# Altium project lab2_zasetskiy_buck.PrjPcb
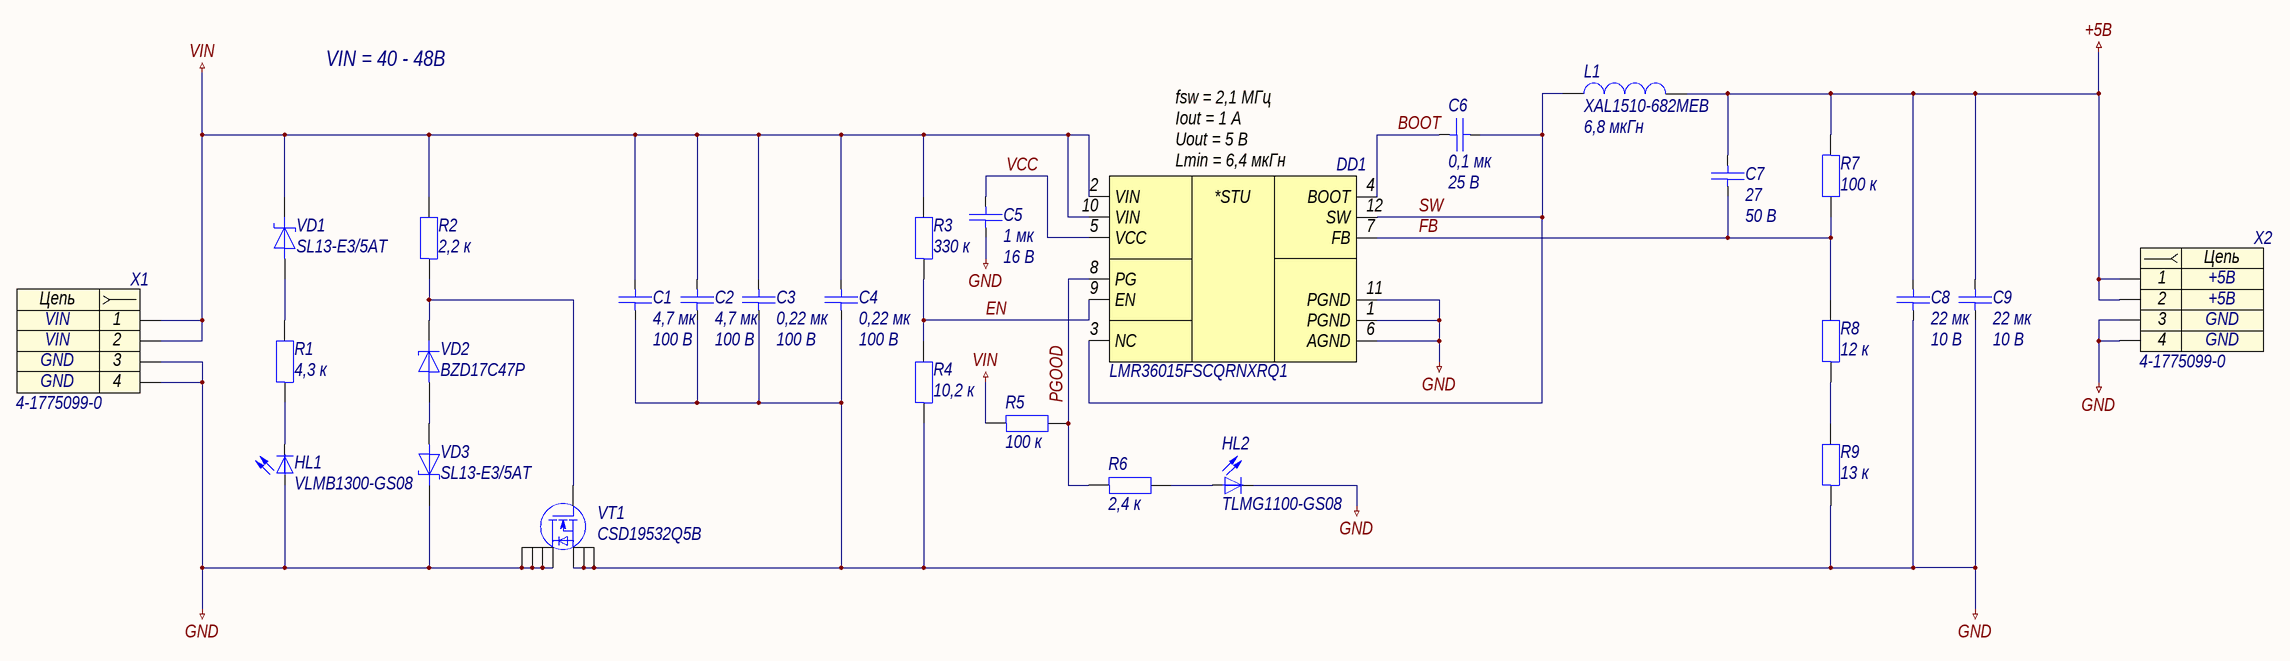
[diagram p0: lab2_zasetskiy_buck.SchDoc]
approver: Капустин; check: Капустин; designation: СПБПУ.3331506.06; developer: Засецкий; document_code: Ý3; document_type: Схема электрическая принципиальная; pcb_dec_number: СПБПУ.3331506.06; project: Лабораторная работа №2; sheets_total: M; title: Понижающий преобразователь; title_line_1: Понижающий; title_line_2: преобразователь
1 sheet, 28 parts. Net scope: global (net labels, ports and power ports of the same name join across sheets).
Board file: lab2_zasetskiy_buck.PcbDoc

## Sheet lab2_zasetskiy_buck.SchDoc: Понижающий преобразователь
size 594 x 420 mm; ApprovedBy: Капустин; CheckedBy: Капустин; DrawnBy: Засецкий; DocumentNumber: СПБПУ.3331506.06Ý3; SheetNumber: n; SheetTotal: M; DocumentCode: Ý3; ImagePath: СПБПУ.3331506.06

### Parts
C1  4,7 мк  Напряжение: 100 В  [C1210]
C2  4,7 мк  Напряжение: 100 В  [C1210]
C3  0,22 мк  Напряжение: 100 В  [C0805]
C4  0,22 мк  Напряжение: 100 В  [C0805]
C5  1 мк  Напряжение: 16 В  [C0603]
C6  0,1 мк  Напряжение: 25 В  [C0603]
C7  27  Напряжение: 50 В  [C0402]
C8  22 мк  Напряжение: 10 В  [C1206]
C9  22 мк  Напряжение: 10 В  [C1206]
DD1  LMR36015FSCQRNXRQ1  [VQFN-HR-12]
HL1  VLMB1300-GS08  [LED]
HL2  TLMG1100-GS08  [LED_GREEN]
L1  XAL1510-682MEB  Индуктивность: 6,8 мкГн  [XAL-2-1620X1520X1100]
R1  4,3 к  [R0603]
R2  2,2 к  [R0603]
R3  330 к  [R0603]
R4  10,2 к  [R0603]
R5  100 к  [R0603]
R6  2,4 к  [R0603]
R7  100 к  [R0603]
R8  12 к  [R0603]
R9  13 к  [R0603]
VD1  SL13-E3/5AT  [DO-214AC]
VD2  BZD17C47P  [DO-219AB]
VD3  SL13-E3/5AT  [DO-214AC]
VT1  CSD19532Q5B  [SON-8]
X1  4-1775099-0  [4-1775099-0]
X2  4-1775099-0  [4-1775099-0]

### Nets
+5В: C7.1 C8.1 C9.1 L1.2 R7.1 X2.1 X2.2
GND: C1.2 C2.2 C3.2 C4.2 C5.2 C8.2 C9.2 DD1.1(PGND) DD1.6(AGND) DD1.11(PGND) HL1.1(A) HL2.2(K) R4.1 R9.1 VD3.1 VT1.D VT1.S X1.3 X1.4 X2.3 X2.4
VIN: C1.1 C2.1 C3.1 C4.1 DD1.2(VIN) DD1.10(VIN) R2.2 R3.2 R5.1 VD1.1 X1.1 X1.2
BOOT: C6.2 DD1.4(BOOT)
EN: DD1.9(EN) R3.1 R4.2
FB: C7.2 DD1.7(FB) R7.2 R8.2
PGOOD: DD1.8(PG) R5.2 R6.1
SW: C6.1 DD1.3(NC) DD1.12(SW) L1.1
VCC: C5.1 DD1.5(VCC)
NetHL1_2: HL1.2(K) R1.1
NetHL2_1: HL2.1(A) R6.2
NetR1_2: R1.2 VD1.2
NetR2_1: R2.1 VD2.1 VT1.G
NetR8_1: R8.1 R9.2
NetVD2_2: VD2.2 VD3.2

### Notes on the sheet
- VIN = 40 - 48В
- (near DD1) fsw = 2,1 МГц
  Iout = 1 А
  Uout = 5 В
  Lmin = 6,4 мкГн
- Перв. примен.
- Справ. №
- Подп. и дата
- Инв. № дубл.
- Нормоконтроль:
- Взам. инв. №
- Изм.
- Лист
- № докум.
- Подп.
- Дата
- Лит.
- Масса
- Масштаб
- Т.контр.
- Пров.
- Разраб.
- Листов
- Разработал:
- Инв. № подл.
- Н.контр.
- Утв.
- Копировал
- Формат
- А2
- (in symbol dd0011) *STU
- (in symbol x0004) Цепь

### Library data of the parts
C1 C2 = c0119: =Описание; ID: c0119; Фамилия: Засецкий; Описание: Конденсатор чип 1210 4,7 мкФ 100 В ±10 %; Наименование: CL32B475KCIZNWE; Производитель: Samsung electro-mechanics; Отклонение: ±10 %; Рабочие температуры: от –55 °С до +125 °С; Температурный коэффициент емкости: X7R; Корпус: 1210; Номинал: 4,7 мк; Номинальное напряжение: 100 В; HelpURL: http://product.samsungsem.com/mlcc/CL32B475KCIZNW.do
C3 C4 = c0120: =Описание; ID: c0120; Фамилия: Засецкий; Описание: Конденсатор чип 0805 0,22 мкФ 100 В ±10 %; Наименование: CL21B224KCFSFNE; Производитель: Samsung electro-mechanics; Отклонение: ±10 %; Рабочие температуры: от –55 °С до +125 °С; Температурный коэффициент емкости: X7R; Корпус: 0805; Номинал: 0,22 мк; Номинальное напряжение: 100 В; HelpURL: http://product.samsungsem.com/mlcc/CL21B224KCFSFN.do
C5 = c0063: =Описание; ID: c0063; Фамилия: Паньков; Описание: Конденсатор чип 0603 1 мкФ 16 В ±10 %; Наименование: CC0603KRX7R7BB105; Производитель: YAGEO Corp.; Отклонение: ±10 %; Рабочие температуры: от –55 °С до +125 °С; Температурный коэффициент емкости: X7R; Корпус: 0603; Номинал: 1 мк; Номинальное напряжение: 16 В; HelpURL: https://www.yageo.com/upload/media/product/products/datasheet/mlcc/UPY-GPHC_X7R_6.3V-to-50V_20.pdf
C6 = c0033: =Описание; ID: c0033; Фамилия: Паньков; Описание: Конденсатор чип 0603 100 нФ 25 В ±10 %; Наименование: CC0603KRX7R8BB104; Производитель: YAGEO Corp.; Отклонение: ±10 %; Рабочие температуры: от –55 °С до +125 °С; Температурный коэффициент емкости: X7R; Корпус: 0603; Номинал: 0,1 мк; Номинальное напряжение: 25 В; HelpURL: https://www.yageo.com/upload/media/product/products/datasheet/mlcc/UPY-GPHC_X7R_6.3V-to-50V_20.pdf
C7 = c0001: =Описание; ID: c0001; Фамилия: Соколов; Описание: Конденсатор чип 0402 27 пФ 50 В ±5 %; Наименование: CL05C270JB5NNNC; Производитель: Samsung electro-mechanics; Отклонение: ±5 %; Рабочие температуры: от –55 °С до +125 °С; Температурный коэффициент емкости: C0G; Корпус: 0402; Номинал: 27; Номинальное напряжение: 50 В; HelpURL: http://product.samsungsem.com/mlcc/CL05C270JB5NNN.do
C8 C9 = c0102: =Описание; ID: c0102; Фамилия: Паньков; Описание: Конденсатор чип 0603 22 мкФ 10 В ±10 %; Наименование: CC1206KRX7R6BB226; Производитель: YAGEO Corp.; Отклонение: ±10 %; Рабочие температуры: от –55 °С до +125 °С; Температурный коэффициент емкости: X7R; Корпус: 1206; Номинал: 22 мк; Номинальное напряжение: 10 В; HelpURL: https://www.yageo.com/upload/media/product/productsearch/datasheet/mlcc/UPY-GPHC_X7R_6.3V-to-50V_20.pdf
DD1 = dd0011: =Описание; ID: dd0011; Фамилия: Засецкий; Описание: Понижающий преобразователь напряжения 60 В и 1,5 А; Производитель: Texas Instruments; Входное напряжение: от 4,2 В до 60 В; Выходное напряжение: от 1 В до 58 В; Коммутируемый ток: до 1,5 А; Частота переключения: от 400 кГц до 2,1 МГц; Рабочие температуры: от –40 °С до +150 °С; Наименование: LMR36015FSCQRNXRQ1; Корпус: VQFN-HR-12; HelpURL: https://www.ti.com/product/LMR36015-Q1
HL1 = hl0003: =Описание; ID: hl0003; Фамилия: Засецкий; Описание: Светодиод синий чип 0603; Производитель: Vishay; Рабочие температуры: от -35 °С до +85 °С; Номинальный ток: 20 мА; Корпус: 0603; Примечание: Синий; Наименование: VLMB1300-GS08; HelpURL: https://www.vishay.com/docs/82437/vlmo1300.pdf
HL2 = hl0002: =Описание; ID: hl0002; Фамилия: Засецкий; Описание: Светодиод зелёный чип 0603; Производитель: Vishay; Рабочие температуры: от -40 °С до +100 °С; Номинальный ток: 30 мА; Корпус: 0603; Примечание: Зелёный; Наименование: TLMG1100-GS08; HelpURL: https://www.vishay.com/docs/83173/tlmb1100.pdf
L1 = l0002: =Описание; ID: l0002; Фамилия: Засецкий; Описание: Катушка индуктивности 6,8 мкГн ±20 %; Производитель: Coilcraft, Inc.; Отклонение: ±20 %; Номинальное активное сопротивление: 4,17 мОм; Максимальное активное сопротивление: 4,6 мОм; Резонансная частота: 11,5 МГц; Номинальный ток (при нагреве на 20 °С/40 °С): 19 А; Ток насыщения: 36 А; Рабочее напряжение: от 0 В до 60 В; Рабочие температуры: от –40 °С до +125 °С; Корпус: 16,2 x 15,2 x 11; Наименование: XAL1510-682MEB; Номинал: 6,8 мкГн; HelpURL: https://www.coilcraft.com/en-us/products/power/shielded-inductors/molded-inductor/xal/xal1510
R1 = r0047: =Описание; ID: r0047; Фамилия: Паньков; Описание: Резистор чип 0603 4,3 кОм ±1 % 0,1 Вт; Наименование: RC0603FR-074K3L; Производитель: YAGEO Corp.; Отклонение: ±1 %; Номинальное напряжение: 75 В; Рабочие температуры: от –55 °С до +155 °С; Номинальный ток: 1 А; Корпус: 0603; Примечание: Ряд E24; Номинал: 4,3 к; HelpURL: https://www.yageo.com/upload/media/product/productsearch/datasheet/rchip/PYu-RC_Group_51_RoHS_L_11.pdf
R2 = r0040: =Описание; ID: r0040; Фамилия: Паньков; Описание: Резистор чип 0603 2,2 кОм ±1 % 0,1 Вт; Наименование: RC0603FR-072K2L; Производитель: YAGEO Corp.; Отклонение: ±1 %; Номинальное напряжение: 75 В; Рабочие температуры: от –55 °С до +155 °С; Номинальный ток: 1 А; Корпус: 0603; Примечание: Ряд E24; Номинал: 2,2 к; HelpURL: https://www.yageo.com/upload/media/product/productsearch/datasheet/rchip/PYu-RC_Group_51_RoHS_L_11.pdf
R3 = r0113: =Описание; ID: r0113; Фамилия: Паньков; Описание: Резистор чип 0603 330 кОм ±1 % 0,1 Вт; Наименование: RC0603FR-07330KL; Производитель: YAGEO Corp.; Отклонение: ±1 %; Номинальное напряжение: 75 В; Рабочие температуры: от –55 °С до +155 °С; Номинальный ток: 1 А; Корпус: 0603; Примечание: Ряд E24; Номинал: 330 к; HelpURL: https://www.yageo.com/upload/media/product/productsearch/datasheet/rchip/PYu-RC_Group_51_RoHS_L_11.pdf
R4 = r0061: =Описание; ID: r0061; Фамилия: Жернаков; Описание: Резистор чип 0603 10,2 кОм ±1 % 0,1 Вт; Наименование: RC0603FR-0710K2L; Производитель: YAGEO Corp.; Отклонение: ±1 %; Номинальное напряжение: 75 В; Рабочие температуры: от –55 °С до +155 °С; Номинальный ток: 1 А; Корпус: 0603; Примечание: Ряд E24; Номинал: 10,2 к; HelpURL: https://www.yageo.com/upload/media/product/productsearch/datasheet/rchip/PYu-RC_Group_51_RoHS_L_11.pdf
R5 R7 = r0094: =Описание; ID: r0094; Фамилия: Водорезов; Описание: Резистор чип 0603 100 кОм ±1 % 0,1 Вт; Наименование: RC0603FR-07100KL; Производитель: YAGEO Corp.; Отклонение: ±1 %; Номинальное напряжение: 75 В; Рабочие температуры: от –55 °С до +155 °С; Номинальный ток: 1 А; Корпус: 0603; Примечание: Ряд E24; Номинал: 100 к; HelpURL: https://www.yageo.com/upload/media/product/productsearch/datasheet/rchip/PYu-RC_Group_51_RoHS_L_11.pdf
R6 = r0041: =Описание; ID: r0041; Фамилия: Паньков; Описание: Резистор чип 0603 2,4 кОм ±1 % 0,1 Вт; Наименование: RC0603FR-072K4L; Производитель: YAGEO Corp.; Отклонение: ±1 %; Номинальное напряжение: 75 В; Рабочие температуры: от –55 °С до +155 °С; Номинальный ток: 1 А; Корпус: 0603; Примечание: Ряд E24; Номинал: 2,4 к; HelpURL: https://www.yageo.com/upload/media/product/productsearch/datasheet/rchip/PYu-RC_Group_51_RoHS_L_11.pdf
R8 = r0063: =Описание; ID: r0063; Фамилия: Паньков; Описание: Резистор чип 0603 12 кОм ±1 % 0,1 Вт; Наименование: RC0603FR-0712KL; Производитель: YAGEO Corp.; Отклонение: ±1 %; Номинальное напряжение: 75 В; Рабочие температуры: от –55 °С до +155 °С; Номинальный ток: 1 А; Корпус: 0603; Примечание: Ряд E24; Номинал: 12 к; HelpURL: https://www.yageo.com/upload/media/product/productsearch/datasheet/rchip/PYu-RC_Group_51_RoHS_L_11.pdf
R9 = r0065: =Описание; ID: r0065; Фамилия: Жернаков; Описание: Резистор чип 0603 13 кОм ±1 % 0,1 Вт; Наименование: RC0603FR-0713KL; Производитель: YAGEO Corp.; Отклонение: ±1 %; Номинальное напряжение: 75 В; Рабочие температуры: от –55 °С до +155 °С; Номинальный ток: 1 А; Корпус: 0603; Примечание: Ряд E24; Номинал: 13 к; HelpURL: https://www.yageo.com/upload/media/product/productsearch/datasheet/rchip/PYu-RC_Group_51_RoHS_L_11.pdf
VD1 VD3 = vd0002: =Описание; ID: vd0002; Фамилия: Ларионов; Описание: Диод Шоттки 30 В 1,5 А; Производитель: Vishay Intertechnology, Inc.; Пиковое прямое напряжение: 0,445 В; Импульсное обратное напряжение: 30 В; Макс допустимый средний прямой ток: 1,5 А; Рабочие температуры: от –55 °С до +125 °С; Наименование: SL13-E3/5AT; Корпус: DO-214AC; HelpURL: https://www.vishay.com/product?docid=88740
VD2 = vd0028: =Описание; ID: vd0028; Фамилия: Паньков; Описание: Стабилитрон 47 В; Производитель: Vishay Intertechnology, Inc.; Номинальное напряжение стабилизации: 47 В; Разброс напряжения стабилизации: 44,0...50,0 В; Номинальный ток стабилизации: 10 мА; Рабочие температуры: от –55 °С до +150 °С; Наименование: BZD17C47P; Корпус: DO-219AB; HelpURL: https://www.vishay.com/product?docid=85161
VT1 = vt0001: =Описание; ID: vt0001; Фамилия: Жернаков; Описание: Транзистор полевой N-канальный 100 В 17 А; Производитель: Texas Instruments; Напряжение затвор — исток: ±20 В; Напряжение сток — исток: 100 В; Ток стока: 17 А; Сопротивление сток — исток: 0,0057 Ом; Рабочие температуры: от –55 °С до +150 °С; Наименование: CSD19532Q5B; Корпус: SON-8; HelpURL: https://www.ti.com/product/CSD19532Q5B
X1 = x0004: =Описание; Contact_1: VIN; Contact_3: GND; ID: x0004; Фамилия: Ларионов; Описание: ATX Power 4 pin гнездо прямой; Производитель: TE Connectivity; Contact_2: VIN; Contact_4: GND; Наименование: 4-1775099-0; HelpURL: https://www.te.com/usa-en/product-4-1775099-0.html
X2 = x0004: =Описание; Contact_1: +5В; Contact_3: GND; ID: x0004; Фамилия: Ларионов; Описание: ATX Power 4 pin гнездо прямой; Производитель: TE Connectivity; Contact_2: +5В; Contact_4: GND; Наименование: 4-1775099-0; HelpURL: https://www.te.com/usa-en/product-4-1775099-0.html